# Altium project FPGA_Core_FX3.PrjPcb
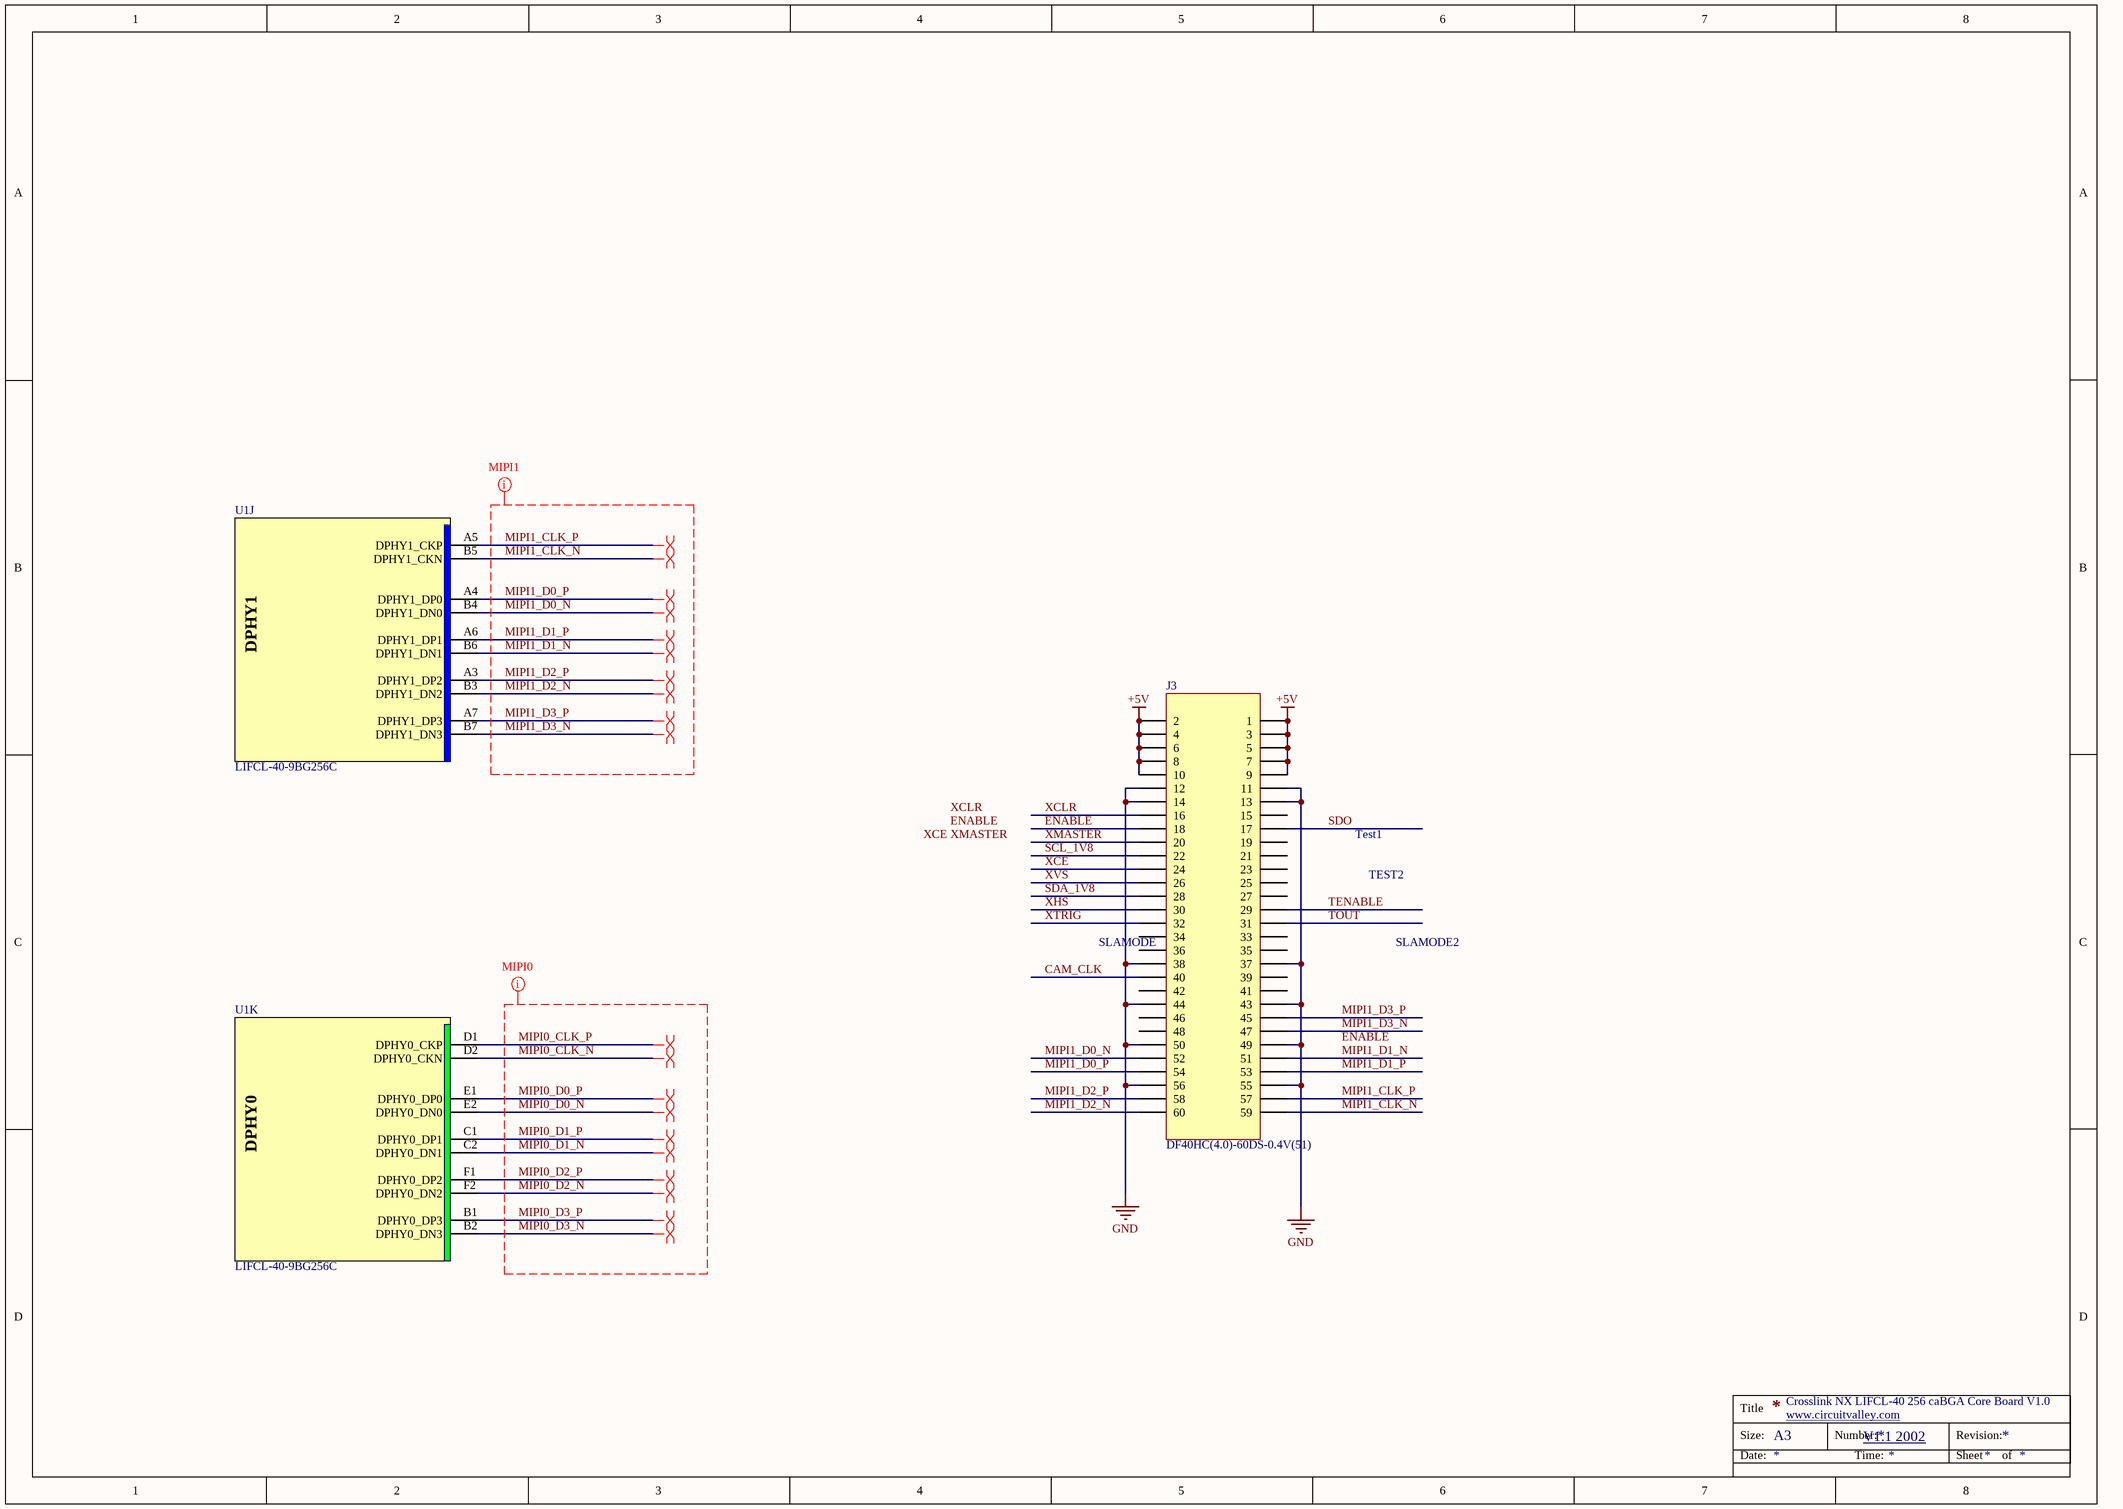
[diagram p0: camera.SchDoc]
6 sheets, 81 parts. Net scope: global (net labels, ports and power ports of the same name join across sheets).
Board file: FPGA_Core_FX3.PcbDoc
Sheets:
  camera.SchDoc
  power.SchDoc
  fpga_gpif.SchDoc
  fpga_power.SchDoc
  psram.SchDoc
  fpga_flash.SchDoc

## Sheet camera.SchDoc
size A3

### Parts
J3  DF40HC(4.0)-60DS-0.4V(51)  [DF40HC(4.0)-60DS-0.4V(51)]
U1  LIFCL-40-9BG256C  [Lattice_256_CABGA]  (parts J,K of 14)

### Nets
+5V: J3.1 J3.2 J3.3 J3.4 J3.5 J3.6 J3.7 J3.8 J3.9 J3.10
GND: J3.11 J3.12 J3.13 J3.14 J3.37 J3.38 J3.43 J3.44 J3.49 J3.50 J3.55 J3.56
CAM_CLK: J3.40
ENABLE: J3.18
MIPI0_CLK_N: U1.D2(DPHY0_CKN)
MIPI0_CLK_P: U1.D1(DPHY0_CKP)
MIPI0_D0_N: U1.E2(DPHY0_DN0)
MIPI0_D0_P: U1.E1(DPHY0_DP0)
MIPI0_D1_N: U1.C2(DPHY0_DN1)
MIPI0_D1_P: U1.C1(DPHY0_DP1)
MIPI0_D2_N: U1.F2(DPHY0_DN2)
MIPI0_D2_P: U1.F1(DPHY0_DP2)
MIPI0_D3_N: U1.B2(DPHY0_DN3)
MIPI0_D3_P: U1.B1(DPHY0_DP3)
MIPI1_CLK_N: J3.59 U1.B5(DPHY1_CKN)
MIPI1_CLK_P: J3.57 U1.A5(DPHY1_CKP)
MIPI1_D0_N: J3.52 U1.B4(DPHY1_DN0)
MIPI1_D0_P: J3.54 U1.A4(DPHY1_DP0)
MIPI1_D1_N: J3.51 U1.B6(DPHY1_DN1)
MIPI1_D1_P: J3.53 U1.A6(DPHY1_DP1)
MIPI1_D2_N: J3.60 U1.B3(DPHY1_DN2)
MIPI1_D2_P: J3.58 U1.A3(DPHY1_DP2)
MIPI1_D3_N: J3.47 U1.B7(DPHY1_DN3)
MIPI1_D3_P: J3.45 U1.A7(DPHY1_DP3)
SCL_1V8: J3.22
SDA_1V8: J3.28
SDO: J3.17
TENABLE: J3.29
TOUT: J3.31
XCE: J3.24
XCLR: J3.16
XHS: J3.30
XMASTER: J3.20
XTRIG: J3.32
XVS: J3.26

Not connected (* = marked no-connect by the designer): J3 15 19 21 23 25 27 33 34 35 36 39 41 42 46 48

### Layout directives
differential pair: MIPI0_CLK_N, MIPI0_CLK_P, MIPI0_D0_N, MIPI0_D0_P, MIPI0_D1_N, MIPI0_D1_P, MIPI0_D2_N, MIPI0_D2_P, MIPI0_D3_N, MIPI0_D3_P, MIPI1_CLK_N, MIPI1_CLK_P, MIPI1_D0_N, MIPI1_D0_P, MIPI1_D1_N, MIPI1_D1_P, MIPI1_D2_N, MIPI1_D2_P, MIPI1_D3_N, MIPI1_D3_P
net class MIPI0: MIPI0_CLK_N, MIPI0_CLK_P, MIPI0_D0_N, MIPI0_D0_P, MIPI0_D1_N, MIPI0_D1_P, MIPI0_D2_N, MIPI0_D2_P, MIPI0_D3_N, MIPI0_D3_P
net class MIPI1: MIPI1_CLK_N, MIPI1_CLK_P, MIPI1_D0_N, MIPI1_D0_P, MIPI1_D1_N, MIPI1_D1_P, MIPI1_D2_N, MIPI1_D2_P, MIPI1_D3_N, MIPI1_D3_P

### Notes on the sheet
- Test1
- TEST2
- SLAMODE
- SLAMODE2
- Crosslink NX LIFCL-40 256 caBGA Core Board V1.0
- www.circuitvalley.com <http://www.circuitvalley.com>
- V1.1 2002
- Labels drawn without touching a wire or pin: ENABLE, XCE, XCLR, XMASTER
- Title
- Size:
- Date:
- A3
- Number:
- Time:
- Revision:
- Sheet
- of
- (in symbol LIFCL-40-9BG256C, part J) DPHY1
- (in symbol LIFCL-40-9BG256C, part K) DPHY0

### Library data of the parts
J3 = DF40HC(4.0)-60DS-0.4V(51): Hiros 60 pin Connector
U1 = LIFCL-40-9BG256C: FPGA CorsslinkNX  LIFCL-40-9BG256C

## Sheet power.SchDoc
size A3
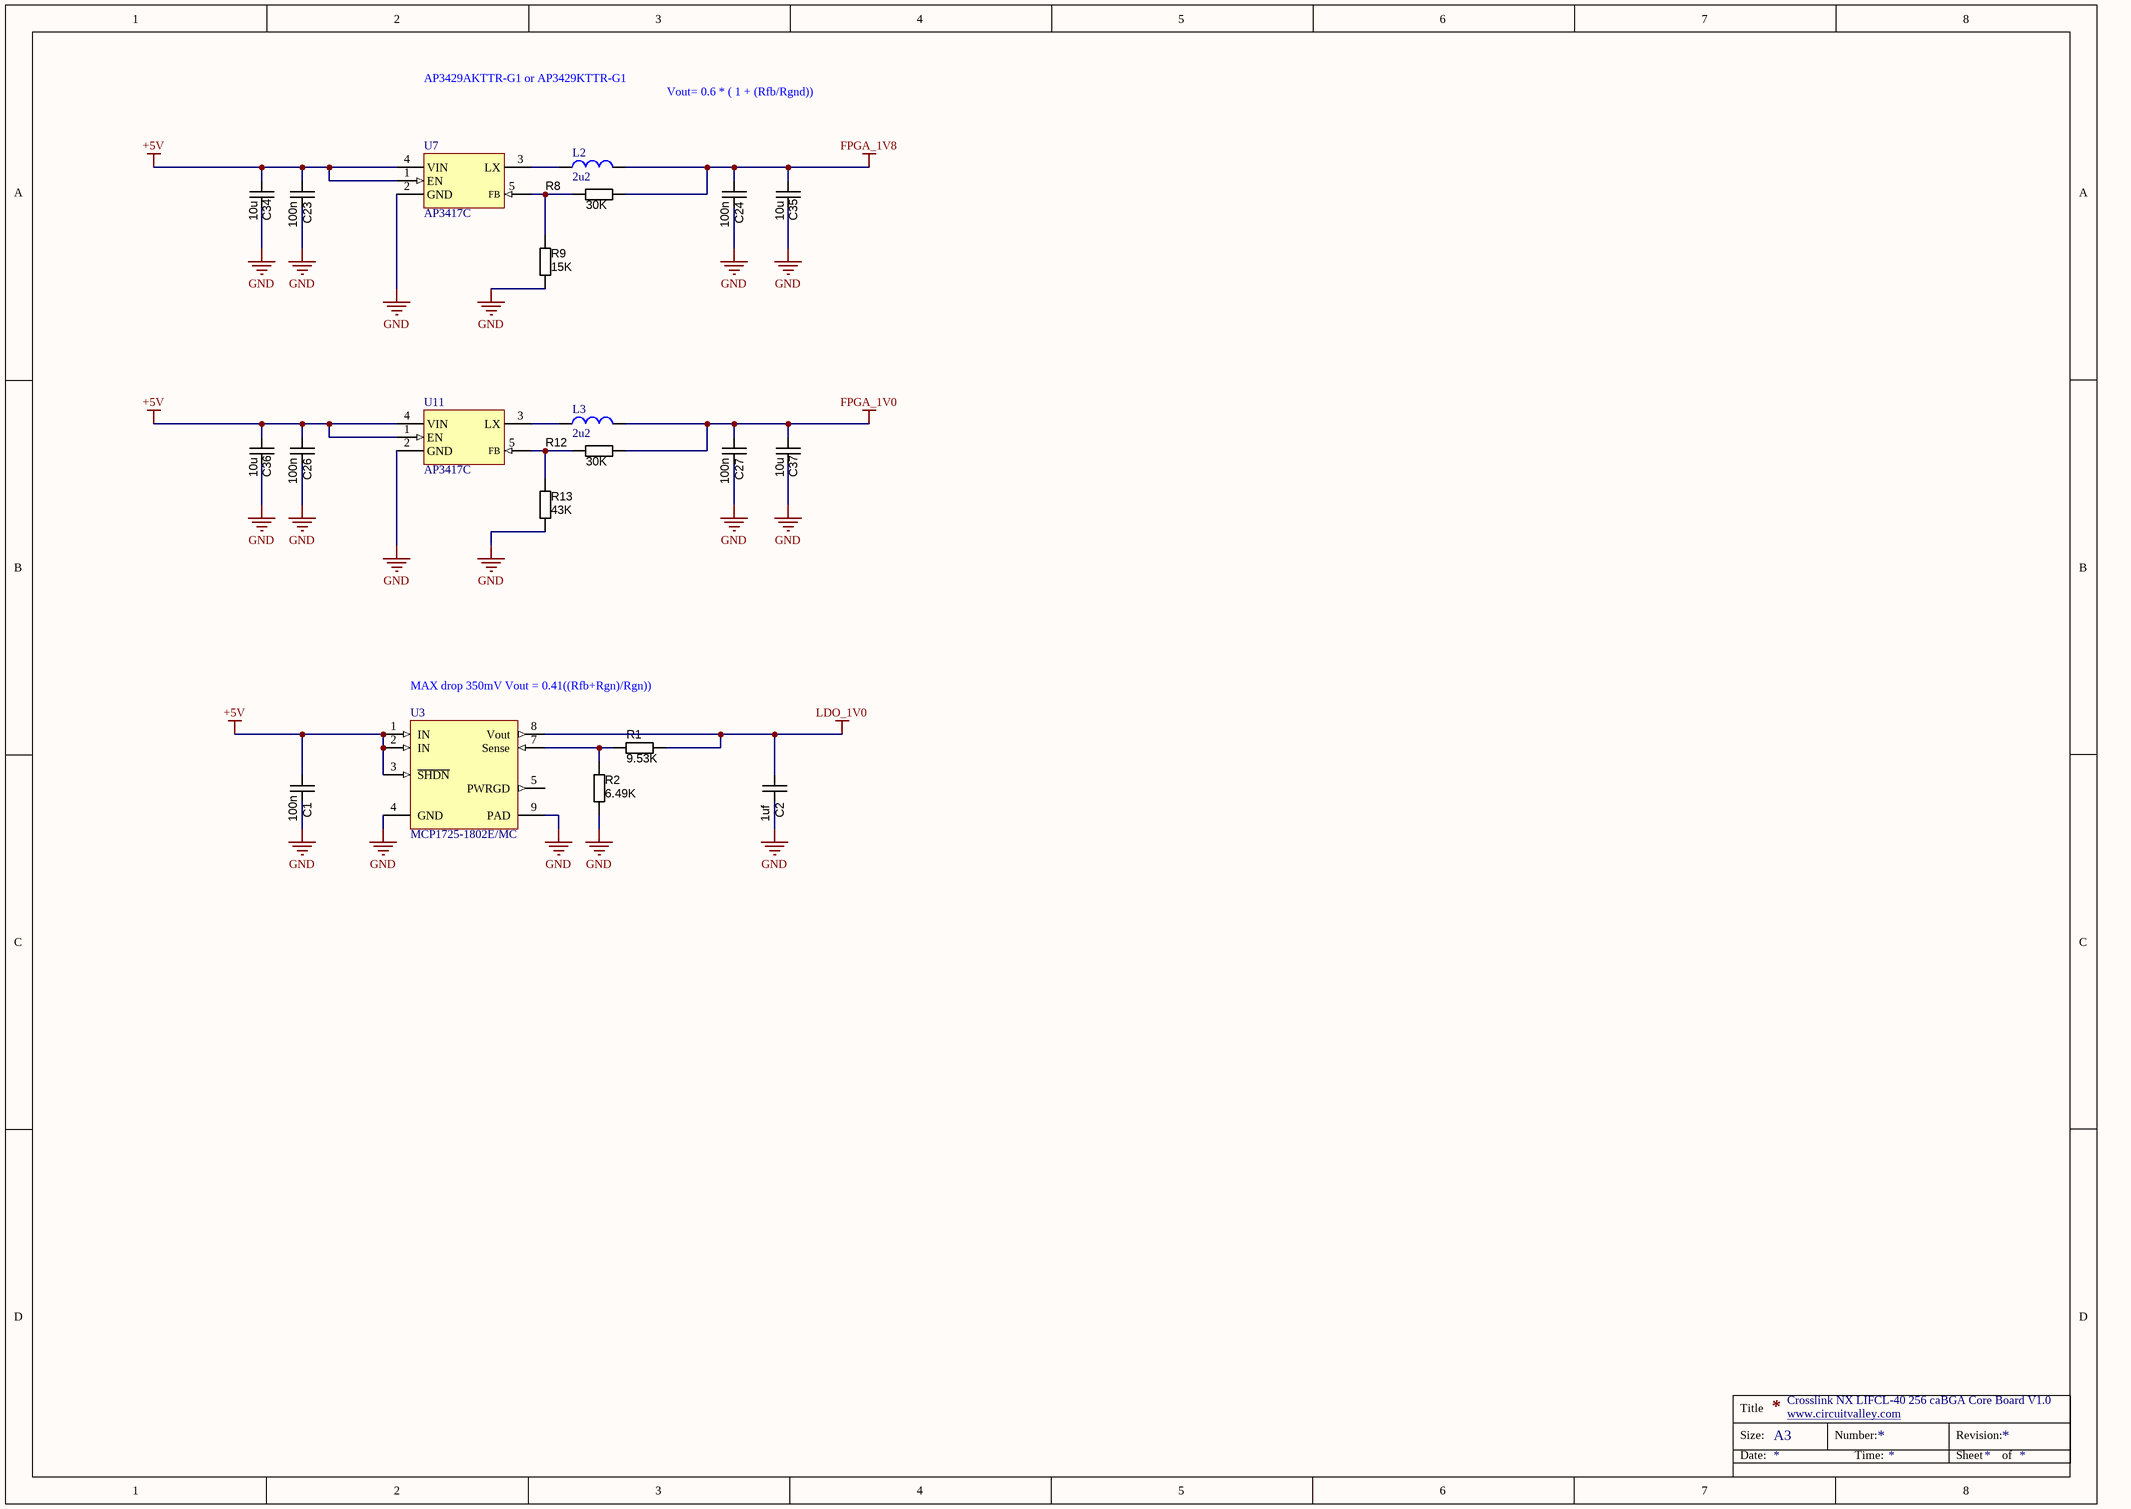
[diagram p1: power.SchDoc]

### Parts
C1  100n  [CAPC1005N]
C2  1uf  [CAPC1005N]
C23  100n  [CAPC1005N]
C24  100n  [CAPC1005N]
C26  100n  [CAPC1005N]
C27  100n  [CAPC1005N]
C34  value 10u  [CAPC1608N]  (hidden comment: approved sub OK)
C35  value 10u  [CAPC1608N]  (hidden comment: approved sub OK)
C36  value 10u  [CAPC1608N]  (hidden comment: approved sub OK)
C37  value 10u  [CAPC1608N]  (hidden comment: approved sub OK)
L2  2u2  [FDSD0420-H-2R2M]
L3  2u2  [FDSD0420-H-2R2M]
R1  value 9.53K  [RESC1005N]  (hidden comment: Thick Film)
R2  value 6.49K  [RESC1005N]  (hidden comment: Thick Film)
R8  value 30K  [RESC1005N]  (hidden comment: Thick Film)
R9  value 15K  [RESC1005N]  (hidden comment: Thick Film)
R12  value 30K  [RESC1005N]  (hidden comment: Thick Film)
R13  value 43K  [RESC1005N]  (hidden comment: Thick Film)
U3  MCP1725-1802E/MC  [DFN8_3x2]
U7  AP3417C  [SOT23-5]
U11  AP3417C  [SOT23-5]

### Nets
+5V: C1.2 C23.2 C26.2 C34.1 C36.1 U3.1(IN) U3.2(IN) U3.3(~{SHDN}) U7.1(EN) U7.4(VIN) U11.1(EN) U11.4(VIN)
FPGA_1V0: C27.2 C37.1 L3.2 R12.2
FPGA_1V8: C24.2 C35.1 L2.2 R8.2
GND: C1.1 C2.1 C23.1 C24.1 C26.1 C27.1 C34.2 C35.2 C36.2 C37.2 R2.1 R9.2 R13.1 U3.4(GND) U3.9(PAD) U7.2(GND) U11.2(GND)
LDO_1V0: C2.2 R1.2 U3.8(Vout)
NetL2_1: L2.1 U7.3(LX)
NetL3_1: L3.1 U11.3(LX)
NetR1_1: R1.1 R2.2 U3.7(Sense)
NetR8_1: R8.1 R9.1 U7.5(FB)
NetR12_1: R12.1 R13.2 U11.5(FB)

Not connected (* = marked no-connect by the designer): U3 5(PWRGD)

### Notes on the sheet
- AP3429AKTTR-G1 or AP3429KTTR-G1
- Vout= 0.6 * ( 1 + (Rfb/Rgnd))
- MAX drop 350mV Vout = 0.41((Rfb+Rgn)/Rgn))
- Crosslink NX LIFCL-40 256 caBGA Core Board V1.0
- www.circuitvalley.com <http://www.circuitvalley.com>
- Title
- Size:
- Date:
- A3
- Number:
- Time:
- Revision:
- Sheet
- of

### Library data of the parts
C1 C2 C23 C24 C26 C27 = CAPC_10n_0402_16V_10%: Capacitor SMD Cer 10nF 10% 16V X7R 0402; Manufacturer 1: AVX Corporation; Manufacturer Part Number 1: 0402YC103KAT2A; Ratings: 16V; X7R; Tolerance: ±10%; Operating Temperature: -55°C ~ 125°C; Package / Case: 0402 (1005 Metric); Size / Dimension: 0.039" L x 0.020" W (1.00mm x 0.50mm); Manufacturer 2: Yageo; Manufacturer Part Number 2: CC0402KRX7R7BB103; Supplier 1: Digi-Key; Supplier Part Number 1: 478-1114-1-ND; ComponentLink1URL: http://www.avx.com/docs/Catalogs/cx7r.pdf; ComponentLink1Description: http://www.avx.com/docs/Catalogs/cx7r.pdf; Supplier 2: Digi-Key; Supplier Part Number 2: 311-1042-1-ND; ComponentLink2URL: http://www.yageo.com/documents/recent/UPY-GPHC_X7R_6.3V-to-50V_8.pdf; ComponentLink2Description: http://www.yageo.com/documents/recent/UPY-GPHC_X7R_6.3V-to-50V_8.pdf
  C1 C23 C24 C26 C27: Value: 100n
  C2: Value: 1uf
C34-C37 = CAPC_560p_0603_5%: Capacitor SMD Cer 560pF 5% 50V NP0 0603; Manufacturer 1: AVX Corporation; Manufacturer Part Number 1: 06035A561JAT2A; Ratings: 50V; NP0; Material: ceramic; Capacitance: 470pF; Package / Case: 0603 (1608 metric); Voltage - Rated: 50V; Mounting Type: Surface Mount, MLCC; Operating Temperature: -55°C ~ 125°C; Applications: General Purpose; Size / Dimension: 0.063" L x 0.032" W (1.60mm x 0.81mm); Height - Seated (Max): -; Thickness (Max): 0.035" (0.90mm); Lead Spacing: -; Lead Style: -; ComponentLink1URL: http://www.avx.com/docs/Catalogs/ccog.pdf; ComponentLink1Description: http://www.avx.com/docs/Catalogs/ccog.pdf; Supplier 1: Digi-Key; Supplier Part Number 1: 478-1184-1-ND
L2 L3 = inductor_smd
R1 R2 R8 R9 R12 R13 = RES_3K3_0402_5%: Resistor SMD chip 3.3k Ohm 0.063W 5% 0402; Manufacturer 1: Yageo; Manufacturer Part Number 1: RC0402JR-073K3L; Ratings: 1/16 W; Package / Case: 0402 (1005 metric); Tolerance: ±5%; Material: Thick Film; Supplier 1: Digi-Key; Supplier Part Number 1: 311-3.3KJRCT-ND; ComponentLink1URL: http://www.yageo.com/documents/recent/PYu-RC0402_51_RoHS_L_6.pdf; ComponentLink1Description: http://www.yageo.com/documents/recent/PYu-RC0402_51_RoHS_L_6.pdf
U3 = MCP1725: LDO

## Sheet fpga_gpif.SchDoc
size A3
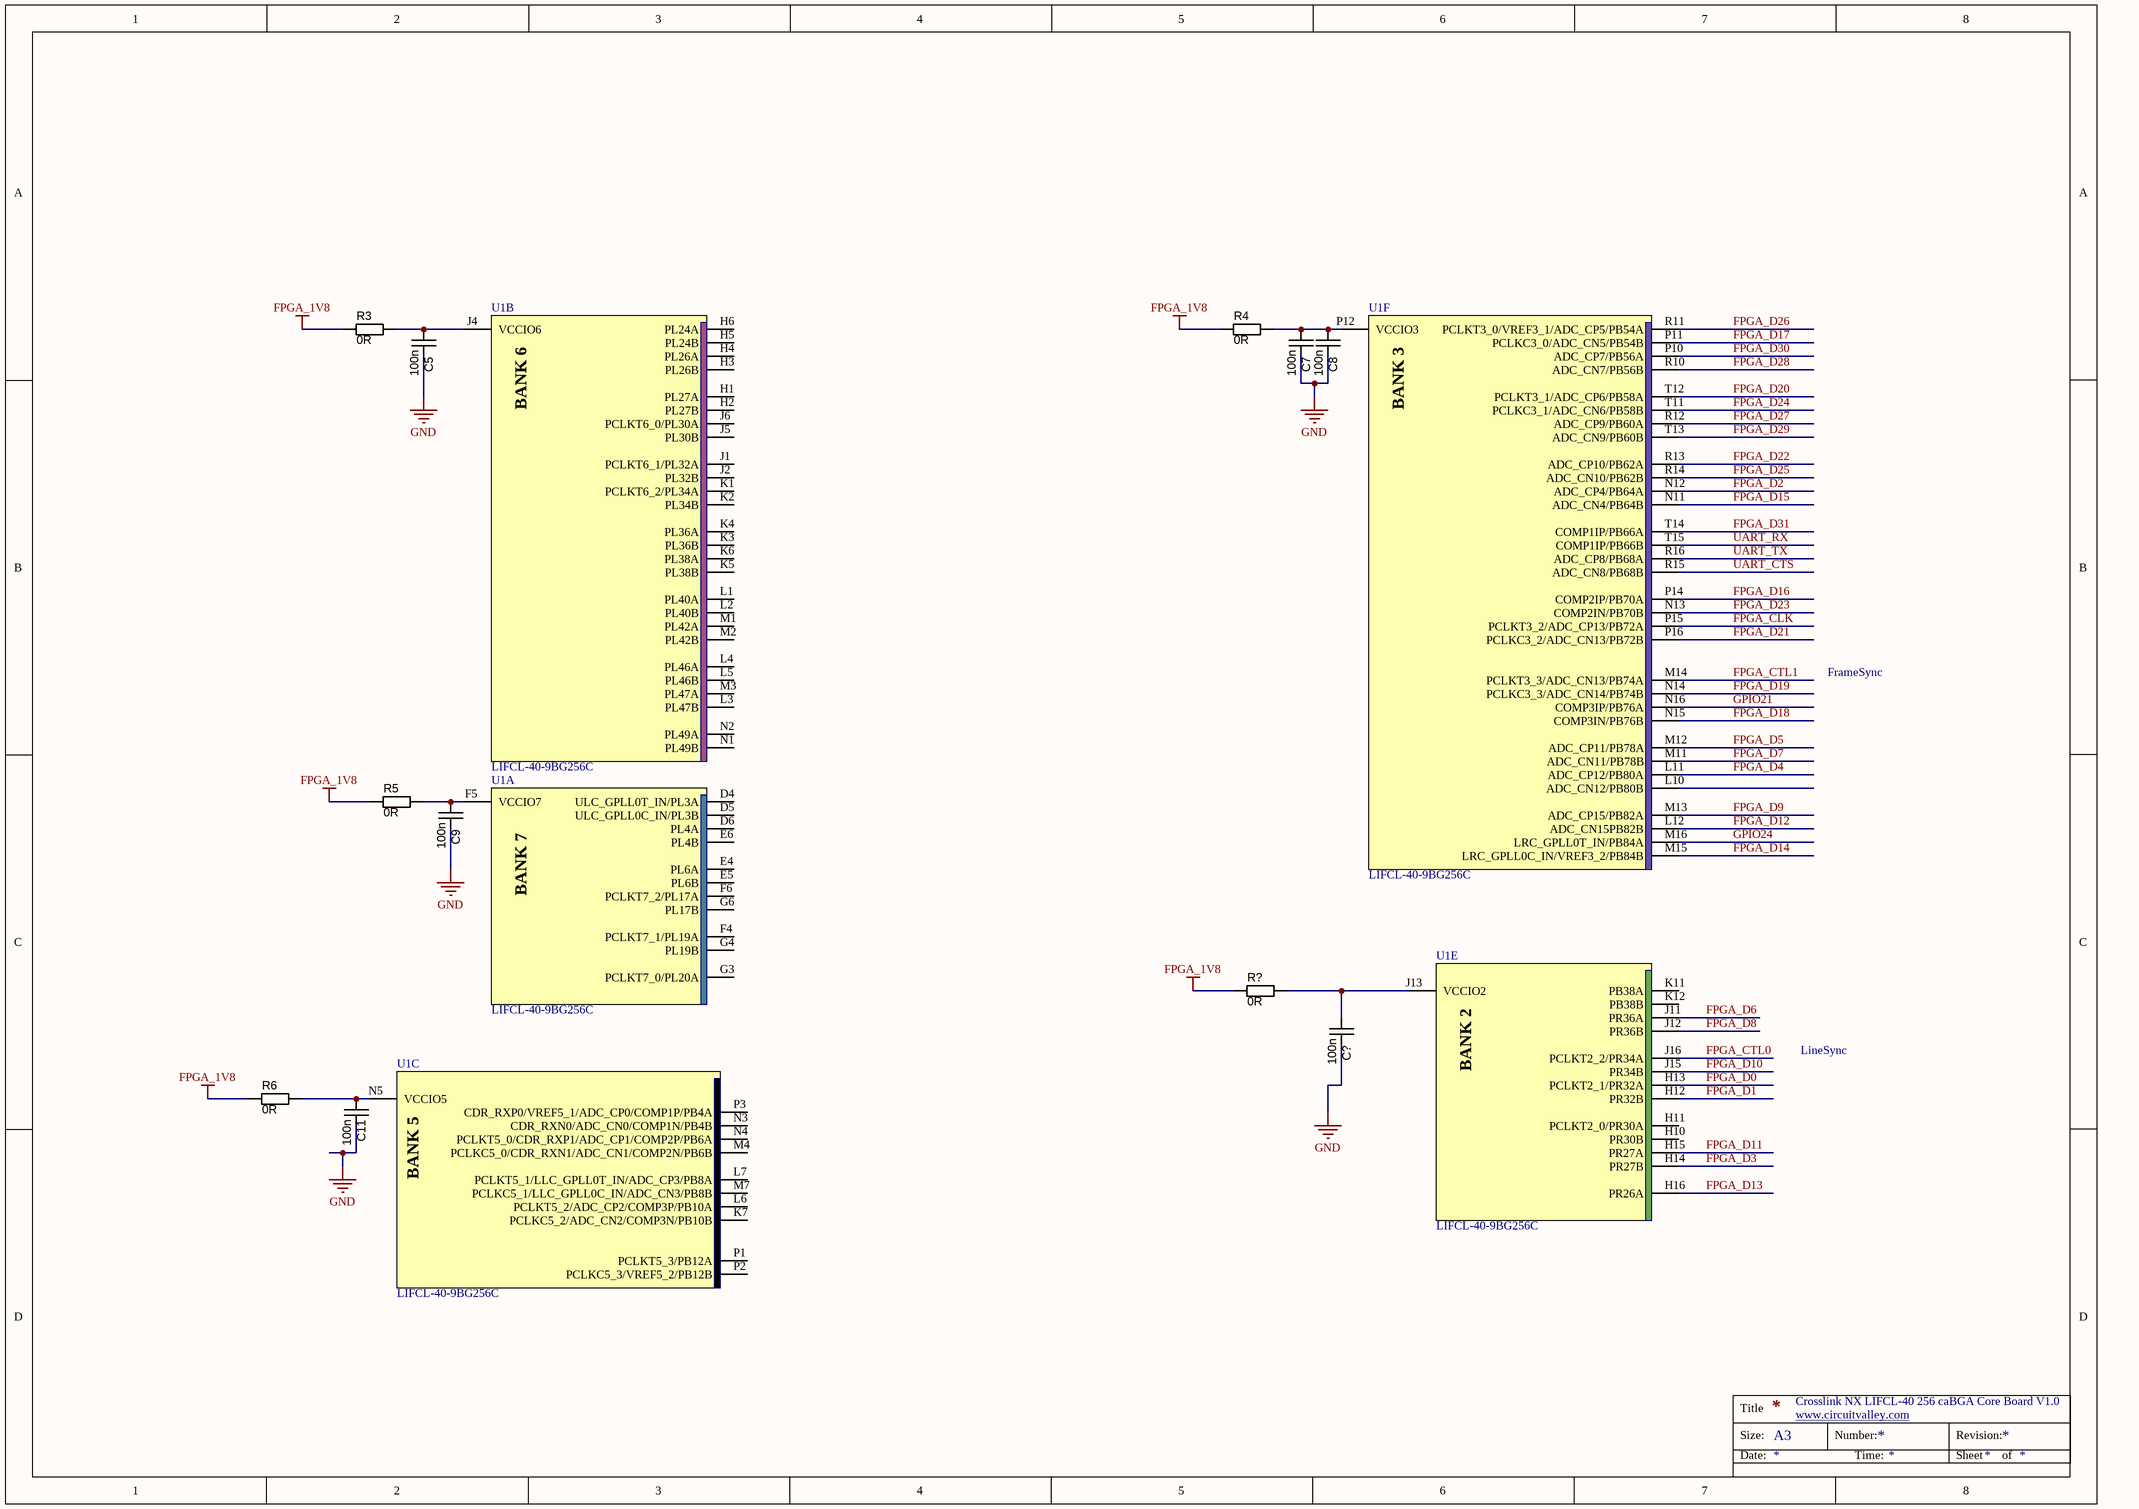
[diagram p2: fpga_gpif.SchDoc]

### Parts
C5  100n  [CAPC1005N]
C7  100n  [CAPC1005N]
C8  100n  [CAPC1005N]
C9  100n  [CAPC1005N]
C11  100n  [CAPC1005N]
C?  100n  [CAPC1005N]
R3  value 0R  [RESC1005N]  (hidden comment: Thick Film)
R4  value 0R  [RESC1005N]  (hidden comment: Thick Film)
R5  value 0R  [RESC1005N]  (hidden comment: Thick Film)
R6  value 0R  [RESC1005N]  (hidden comment: Thick Film)
R?  value 0R  [RESC1005N]  (hidden comment: Thick Film)
U1  LIFCL-40-9BG256C  [Lattice_256_CABGA]  (parts A,B,C,E,F of 14)

### Nets
FPGA_1V8: R3.1 R4.1 R5.1 R6.1 R?.1
GND: C5.1 C7.1 C8.1 C9.1 C11.1 C?.1
FPGA_CLK: U1.P15(PCLKT3_2/ADC_CP13/PB72A)
FPGA_CTL0: U1.J16(PCLKT2_2/PR34A)
FPGA_CTL1: U1.M14(PCLKT3_3/ADC_CN13/PB74A)
FPGA_D0: U1.H13(PCLKT2_1/PR32A)
FPGA_D1: U1.H12(PR32B)
FPGA_D2: U1.N12(ADC_CP4/PB64A)
FPGA_D3: U1.H14(PR27B)
FPGA_D4: U1.L11(ADC_CP12/PB80A)
FPGA_D5: U1.M12(ADC_CP11/PB78A)
FPGA_D6: U1.J11(PR36A)
FPGA_D7: U1.M11(ADC_CN11/PB78B)
FPGA_D8: U1.J12(PR36B)
FPGA_D9: U1.M13(ADC_CP15/PB82A)
FPGA_D10: U1.J15(PR34B)
FPGA_D11: U1.H15(PR27A)
FPGA_D12: U1.L12(ADC_CN15PB82B)
FPGA_D13: U1.H16(PR26A)
FPGA_D14: U1.M15(LRC_GPLL0C_IN/VREF3_2/PB84B)
FPGA_D15: U1.N11(ADC_CN4/PB64B)
FPGA_D16: U1.P14(COMP2IP/PB70A)
FPGA_D17: U1.P11(PCLKC3_0/ADC_CN5/PB54B)
FPGA_D18: U1.N15(COMP3IN/PB76B)
FPGA_D19: U1.N14(PCLKC3_3/ADC_CN14/PB74B)
FPGA_D20: U1.T12(PCLKT3_1/ADC_CP6/PB58A)
FPGA_D21: U1.P16(PCLKC3_2/ADC_CN13/PB72B)
FPGA_D22: U1.R13(ADC_CP10/PB62A)
FPGA_D23: U1.N13(COMP2IN/PB70B)
FPGA_D24: U1.T11(PCLKC3_1/ADC_CN6/PB58B)
FPGA_D25: U1.R14(ADC_CN10/PB62B)
FPGA_D26: U1.R11(PCLKT3_0/VREF3_1/ADC_CP5/PB54A)
FPGA_D27: U1.R12(ADC_CP9/PB60A)
FPGA_D28: U1.R10(ADC_CN7/PB56B)
FPGA_D29: U1.T13(ADC_CN9/PB60B)
FPGA_D30: U1.P10(ADC_CP7/PB56A)
FPGA_D31: U1.T14(COMP1IP/PB66A)
GPIO21: U1.N16(COMP3IP/PB76A)
GPIO24: U1.M16(LRC_GPLL0T_IN/PB84A)
UART_CTS: U1.R15(ADC_CN8/PB68B)
UART_RX: U1.T15(COMP1IP/PB66B)
UART_TX: U1.R16(ADC_CP8/PB68A)
NetC5_2: C5.2 R3.2 U1.J4(VCCIO6)
NetC7_2: C7.2 C8.2 R4.2 U1.P12(VCCIO3)
NetC9_2: C9.2 R5.2 U1.F5(VCCIO7)
NetC11_2: C11.2 R6.2 U1.N5(VCCIO5)
NetC?_2: C?.2 R?.2 U1.J13(VCCIO2)

Not connected (* = marked no-connect by the designer): U1 D4(ULC_GPLL0T_IN/PL3A) D5(ULC_GPLL0C_IN/PL3B) D6(PL4A) E4(PL6A) E5(PL6B) E6(PL4B) F4(PCLKT7_1/PL19A) F6(PCLKT7_2/PL17A) G3(PCLKT7_0/PL20A) G4(PL19B) G6(PL17B) H1(PL27A) H2(PL27B) H3(PL26B) H4(PL26A) H5(PL24B) H6(PL24A) H10(PR30B) H11(PCLKT2_0/PR30A) J1(PCLKT6_1/PL32A) J2(PL32B) J5(PL30B) J6(PCLKT6_0/PL30A) K1(PCLKT6_2/PL34A) K2(PL34B) K3(PL36B) K4(PL36A) K5(PL38B) K6(PL38A) K7(PCLKC5_2/ADC_CN2/COMP3N/PB10B) K11(PB38A) K12(PB38B) L1(PL40A) L2(PL40B) L3(PL47B) L4(PL46A) L5(PL46B) L6(PCLKT5_2/ADC_CP2/COMP3P/PB10A) L7(PCLKT5_1/LLC_GPLL0T_IN/ADC_CP3/PB8A) L10(ADC_CN12/PB80B) M1(PL42A) M2(PL42B) M3(PL47A) M4(PCLKC5_0/CDR_RXN1/ADC_CN1/COMP2N/PB6B) M7(PCLKC5_1/LLC_GPLL0C_IN/ADC_CN3/PB8B) N1(PL49B) N2(PL49A) N3(CDR_RXN0/ADC_CN0/COMP1N/PB4B) N4(PCLKT5_0/CDR_RXP1/ADC_CP1/COMP2P/PB6A) P1(PCLKT5_3/PB12A) P2(PCLKC5_3/VREF5_2/PB12B) P3(CDR_RXP0/VREF5_1/ADC_CP0/COMP1P/PB4A)

### Notes on the sheet
- FrameSync
- LineSync
- Crosslink NX LIFCL-40 256 caBGA Core Board V1.0
- www.circuitvalley.com <http://www.circuitvalley.com>
- Title
- Size:
- Date:
- A3
- Number:
- Time:
- Revision:
- Sheet
- of
- (in symbol LIFCL-40-9BG256C, part A) BANK 7
- (in symbol LIFCL-40-9BG256C, part B) BANK 6
- (in symbol LIFCL-40-9BG256C, part C) BANK 5
- (in symbol LIFCL-40-9BG256C, part E) BANK 2
- (in symbol LIFCL-40-9BG256C, part F) BANK 3

### Library data of the parts
C5 C7-C9 C11 C? = CAPC_10n_0402_16V_10%: as C1 on sheet power; Tolerance: ±10%; Operating Temperature: -55°C ~ 125°C; Package / Case: 0402 (1005 Metric); Size / Dimension: 0.039" L x 0.020" W (1.00mm x 0.50mm); Manufacturer 2: Yageo; Manufacturer Part Number 2: CC0402KRX7R7BB103; Supplier 1: Digi-Key; Supplier Part Number 1: 478-1114-1-ND; ComponentLink1URL: http://www.avx.com/docs/Catalogs/cx7r.pdf; ComponentLink1Description: http://www.avx.com/docs/Catalogs/cx7r.pdf; Supplier 2: Digi-Key; Supplier Part Number 2: 311-1042-1-ND; ComponentLink2URL: http://www.yageo.com/documents/recent/UPY-GPHC_X7R_6.3V-to-50V_8.pdf; ComponentLink2Description: http://www.yageo.com/documents/recent/UPY-GPHC_X7R_6.3V-to-50V_8.pdf; Value: 100n
R3-R6 R? = RES_3K3_0402_5%: as R1 on sheet power; Package / Case: 0402 (1005 metric); Tolerance: ±5%; Material: Thick Film; Supplier 1: Digi-Key; Supplier Part Number 1: 311-3.3KJRCT-ND; ComponentLink1URL: http://www.yageo.com/documents/recent/PYu-RC0402_51_RoHS_L_6.pdf; ComponentLink1Description: http://www.yageo.com/documents/recent/PYu-RC0402_51_RoHS_L_6.pdf
U1 = LIFCL-40-9BG256C: FPGA CorsslinkNX  LIFCL-40-9BG256C

## Sheet fpga_power.SchDoc
size A3
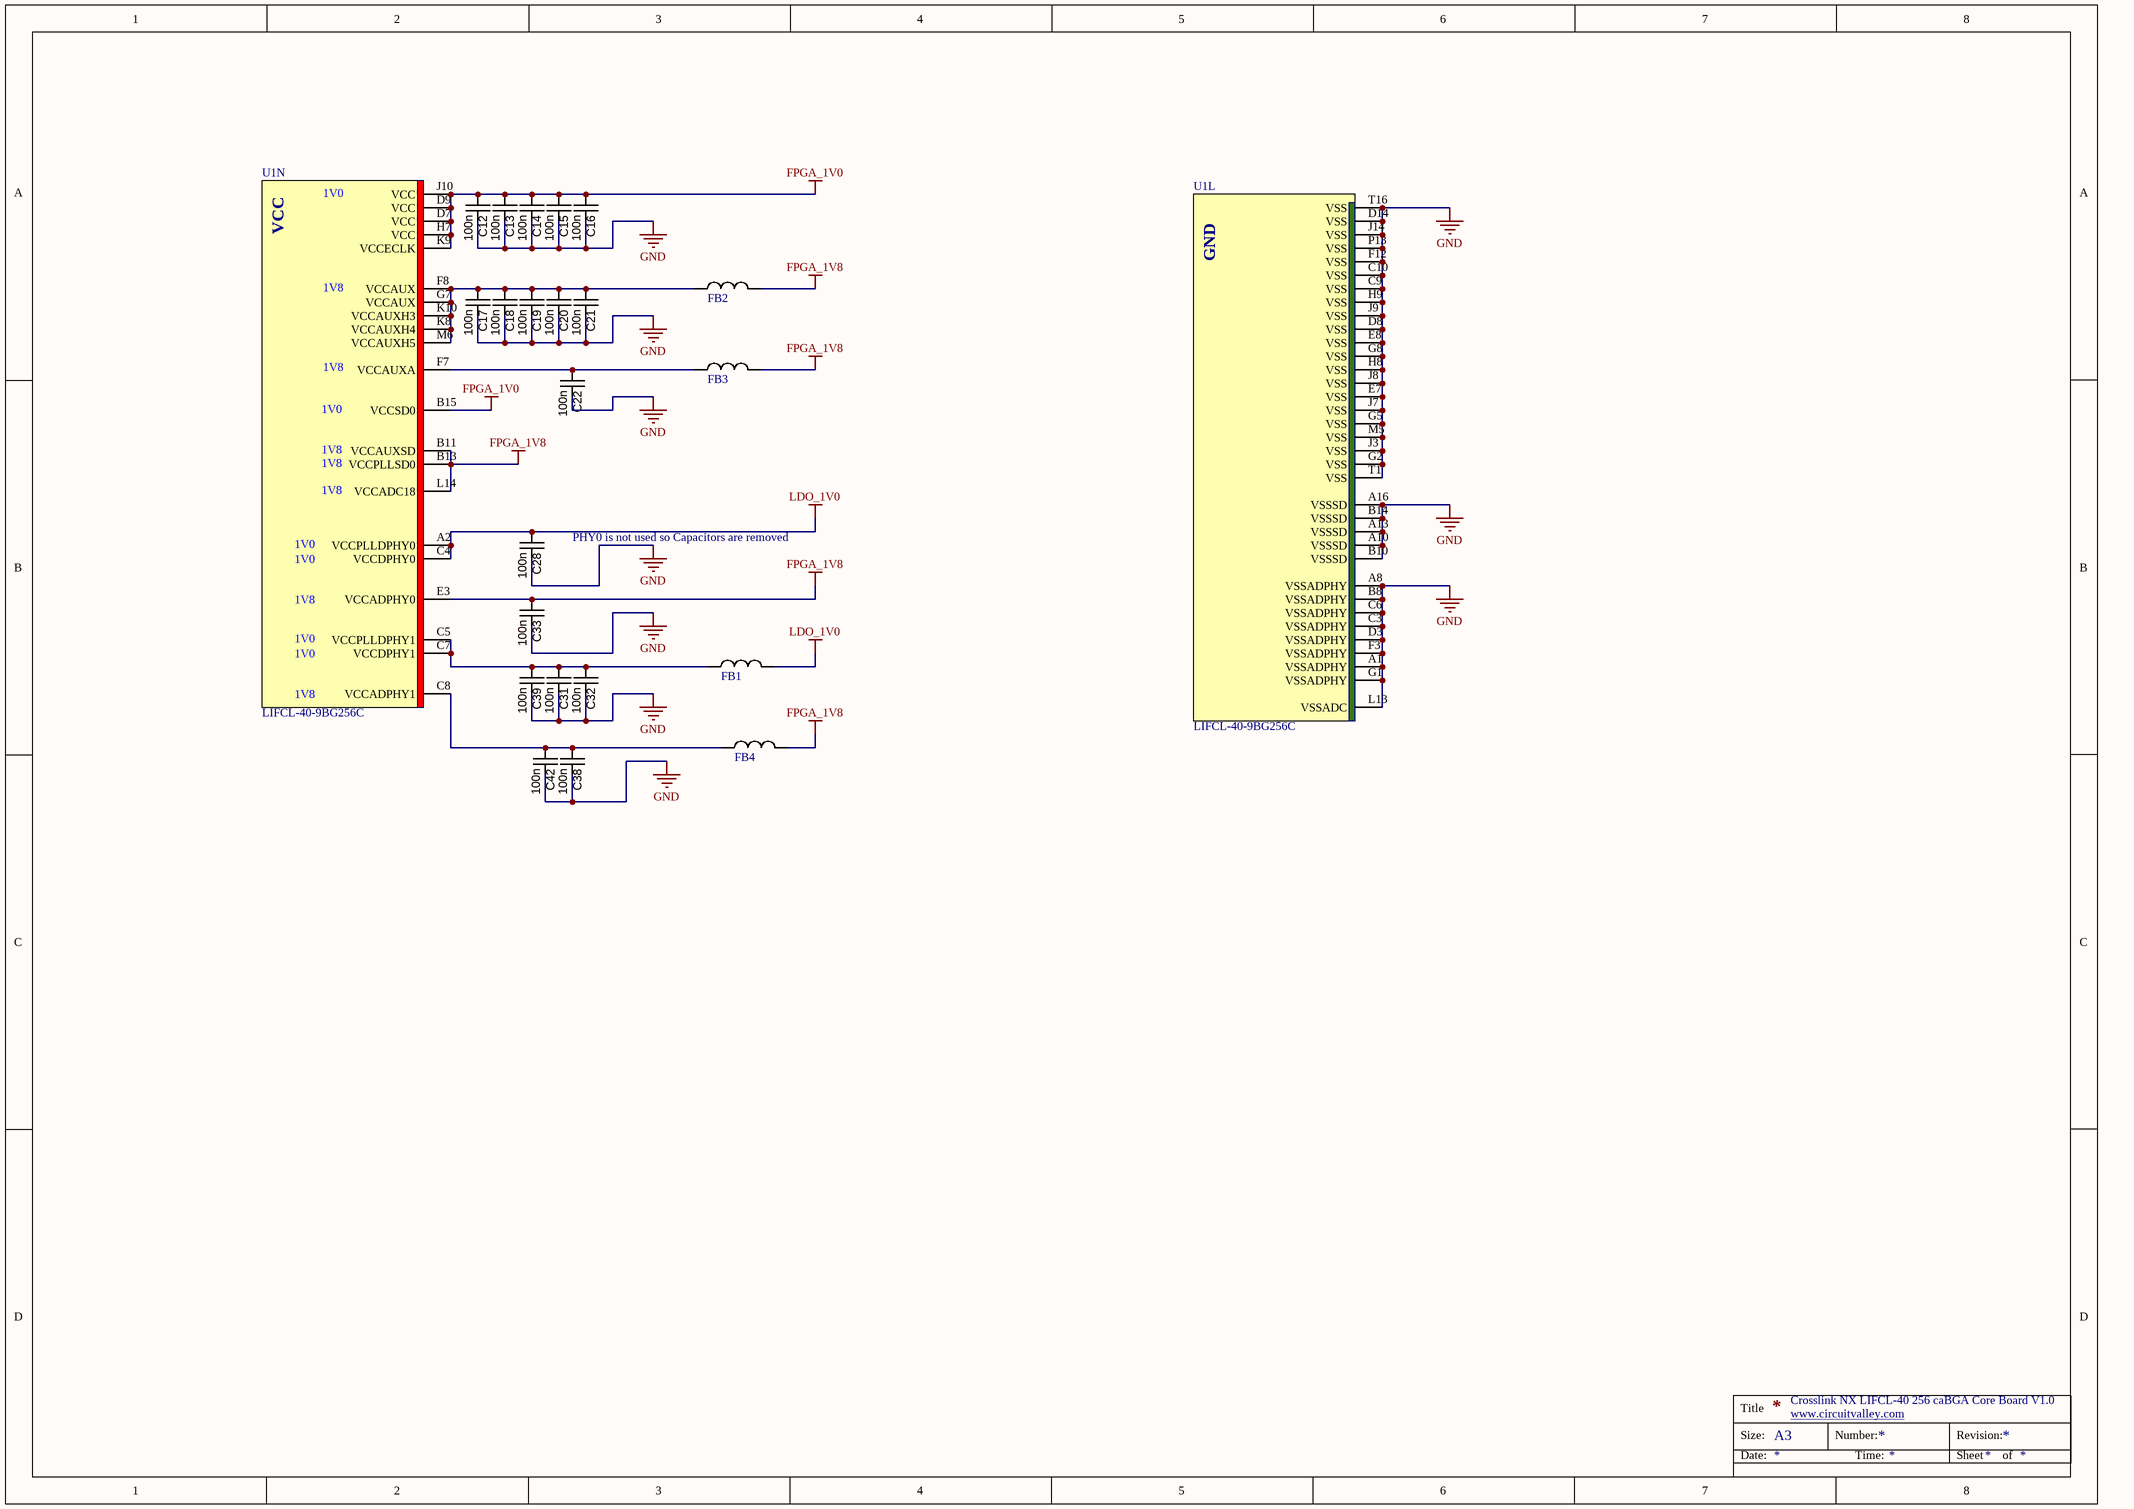
[diagram p3: fpga_power.SchDoc]

### Parts
C12  100n  [CAPC1005N]
C13  100n  [CAPC1005N]
C14  100n  [CAPC1005N]
C15  100n  [CAPC1005N]
C16  100n  [CAPC1005N]
C17  100n  [CAPC1005N]
C18  100n  [CAPC1005N]
C19  100n  [CAPC1005N]
C20  100n  [CAPC1005N]
C21  100n  [CAPC1005N]
C22  100n  [CAPC1005N]
C28  100n  [CAPC1005N]
C31  100n  [CAPC1005N]
C32  100n  [CAPC1005N]
C33  100n  [CAPC1005N]
C38  100n  [CAPC1005N]
C39  100n  [CAPC1005N]
C42  100n  [CAPC1005N]
FB1  Ferrite  [INDC1608N]  (value not drawn)
FB2  Ferrite  [INDC1608N]  (value not drawn)
FB3  Ferrite  [INDC1608N]  (value not drawn)
FB4  Ferrite  [INDC1608N]  (value not drawn)
U1  LIFCL-40-9BG256C  [Lattice_256_CABGA]  (parts L,N of 14)

### Nets
FPGA_1V0: C12.2 C13.2 C14.2 C15.2 C16.2 U1.B15(VCCSD0) U1.D7(VCC) U1.D9(VCC) U1.H7(VCC) U1.J10(VCC) U1.K9(VCCECLK)
FPGA_1V8: C33.2 FB2.2 FB3.2 FB4.2 U1.B11(VCCAUXSD) U1.B13(VCCPLLSD0) U1.E3(VCCADPHY0) U1.L14(VCCADC18)
GND: C12.1 C13.1 C14.1 C15.1 C16.1 C17.1 C18.1 C19.1 C20.1 C21.1 C22.1 C28.1 C31.1 C32.1 C33.1 C38.1 C39.1 C42.1 U1.A1(VSSADPHY) U1.A8(VSSADPHY) U1.A10(VSSSD) U1.A13(VSSSD) U1.A16(VSSSD) U1.B8(VSSADPHY) U1.B10(VSSSD) U1.B14(VSSSD) U1.C3(VSSADPHY) U1.C6(VSSADPHY) U1.C9(VSS) U1.C10(VSS) U1.D3(VSSADPHY) U1.D8(VSS) U1.D14(VSS) U1.E7(VSS) U1.E8(VSS) U1.F3(VSSADPHY) U1.F12(VSS) U1.G1(VSSADPHY) U1.G2(VSS) U1.G5(VSS) U1.G8(VSS) U1.H8(VSS) U1.H9(VSS) U1.J3(VSS) U1.J7(VSS) U1.J8(VSS) U1.J9(VSS) U1.J14(VSS) U1.L13(VSSADC) U1.M5(VSS) U1.P13(VSS) U1.T1(VSS) U1.T16(VSS)
LDO_1V0: C28.2 FB1.2 U1.A2(VCCPLLDPHY0) U1.C4(VCCDPHY0)
NetC17_2: C17.2 C18.2 C19.2 C20.2 C21.2 FB2.1 U1.F8(VCCAUX) U1.G7(VCCAUX) U1.K8(VCCAUXH4) U1.K10(VCCAUXH3) U1.M6(VCCAUXH5)
NetC22_2: C22.2 FB3.1 U1.F7(VCCAUXA)
NetC31_2: C31.2 C32.2 C39.2 FB1.1 U1.C5(VCCPLLDPHY1) U1.C7(VCCDPHY1)
NetC38_2: C38.2 C42.2 FB4.1 U1.C8(VCCADPHY1)

### Notes on the sheet
- (near C28) PHY0 is not used so Capacitors are removed
- Crosslink NX LIFCL-40 256 caBGA Core Board V1.0
- www.circuitvalley.com <http://www.circuitvalley.com>
- Title
- Size:
- Date:
- A3
- Number:
- Time:
- Revision:
- Sheet
- of
- (in symbol LIFCL-40-9BG256C, part L) GND
- (in symbol LIFCL-40-9BG256C, part N) 1V0; 1V8

### Library data of the parts
C12-C22 C28 C31-C33 C38 C39 C42 = CAPC_10n_0402_16V_10%: as C1 on sheet power; Tolerance: ±10%; Operating Temperature: -55°C ~ 125°C; Package / Case: 0402 (1005 Metric); Size / Dimension: 0.039" L x 0.020" W (1.00mm x 0.50mm); Manufacturer 2: Yageo; Manufacturer Part Number 2: CC0402KRX7R7BB103; Supplier 1: Digi-Key; Supplier Part Number 1: 478-1114-1-ND; ComponentLink1URL: http://www.avx.com/docs/Catalogs/cx7r.pdf; ComponentLink1Description: http://www.avx.com/docs/Catalogs/cx7r.pdf; Supplier 2: Digi-Key; Supplier Part Number 2: 311-1042-1-ND; ComponentLink2URL: http://www.yageo.com/documents/recent/UPY-GPHC_X7R_6.3V-to-50V_8.pdf; ComponentLink2Description: http://www.yageo.com/documents/recent/UPY-GPHC_X7R_6.3V-to-50V_8.pdf; Value: 100n
U1 = LIFCL-40-9BG256C: FPGA CorsslinkNX  LIFCL-40-9BG256C

## Sheet psram.SchDoc
size A3
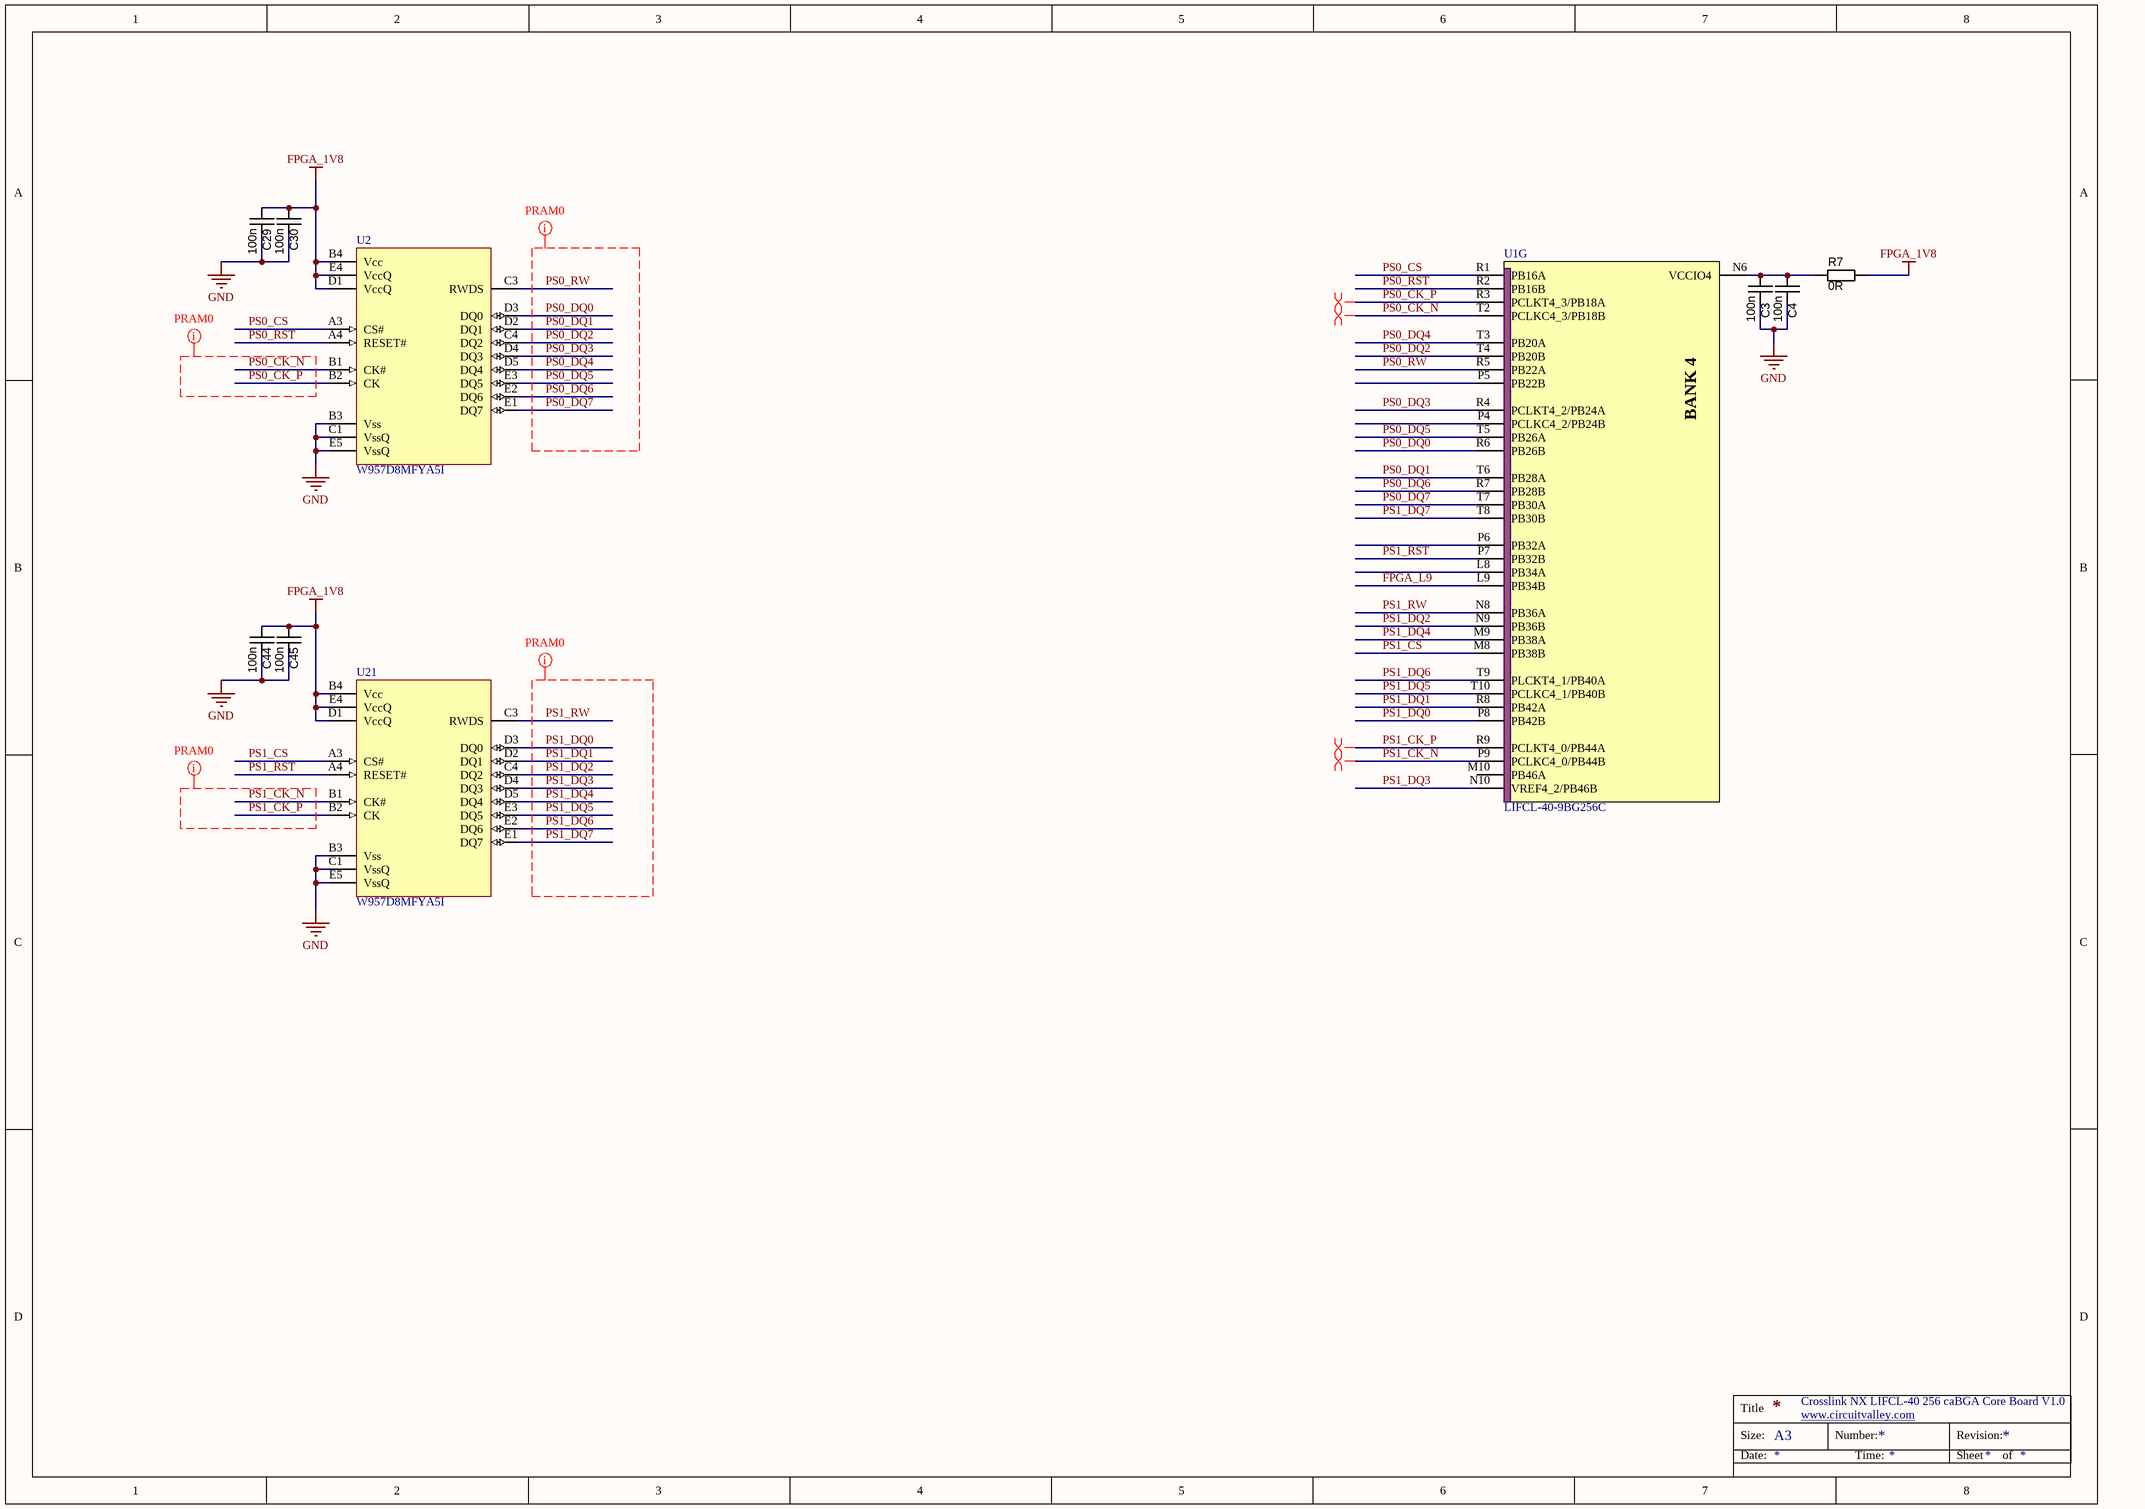
[diagram p4: psram.SchDoc]

### Parts
C3  100n  [CAPC1005N]
C4  100n  [CAPC1005N]
C29  100n  [CAPC1005N]
C30  100n  [CAPC1005N]
C44  100n  [CAPC1005N]
C45  100n  [CAPC1005N]
R7  value 0R  [RESC1005N]  (hidden comment: Thick Film)
U1  LIFCL-40-9BG256C  [Lattice_256_CABGA]  (part G of 14)
U2  W957D8MFYA5I  [TFBGA24]
U21  W957D8MFYA5I  [TFBGA24]

### Nets
FPGA_1V8: C29.2 C30.2 C44.2 C45.2 R7.2 U2.B4(Vcc) U2.D1(VccQ) U2.E4(VccQ) U21.B4(Vcc) U21.D1(VccQ) U21.E4(VccQ)
GND: C3.1 C4.1 C29.1 C30.1 C44.1 C45.1 U2.B3(Vss) U2.C1(VssQ) U2.E5(VssQ) U21.B3(Vss) U21.C1(VssQ) U21.E5(VssQ)
FPGA_L9: U1.L9(PB34B)
PS0_CK_N: U1.T2(PCLKC4_3/PB18B) U2.B1(CK#)
PS0_CK_P: U1.R3(PCLKT4_3/PB18A) U2.B2(CK)
PS0_CS: U1.R1(PB16A) U2.A3(CS#)
PS0_DQ0: U1.R6(PB26B) U2.D3(DQ0)
PS0_DQ1: U1.T6(PB28A) U2.D2(DQ1)
PS0_DQ2: U1.T4(PB20B) U2.C4(DQ2)
PS0_DQ3: U1.R4(PCLKT4_2/PB24A) U2.D4(DQ3)
PS0_DQ4: U1.T3(PB20A) U2.D5(DQ4)
PS0_DQ5: U1.T5(PB26A) U2.E3(DQ5)
PS0_DQ6: U1.R7(PB28B) U2.E2(DQ6)
PS0_DQ7: U1.T7(PB30A) U2.E1(DQ7)
PS0_RST: U1.R2(PB16B) U2.A4(RESET#)
PS0_RW: U1.R5(PB22A) U2.C3(RWDS)
PS1_CK_N: U1.P9(PCLKC4_0/PB44B) U21.B1(CK#)
PS1_CK_P: U1.R9(PCLKT4_0/PB44A) U21.B2(CK)
PS1_CS: U1.M8(PB38B) U21.A3(CS#)
PS1_DQ0: U1.P8(PB42B) U21.D3(DQ0)
PS1_DQ1: U1.R8(PB42A) U21.D2(DQ1)
PS1_DQ2: U1.N9(PB36B) U21.C4(DQ2)
PS1_DQ3: U1.N10(VREF4_2/PB46B) U21.D4(DQ3)
PS1_DQ4: U1.M9(PB38A) U21.D5(DQ4)
PS1_DQ5: U1.T10(PCLKC4_1/PB40B) U21.E3(DQ5)
PS1_DQ6: U1.T9(PLCKT4_1/PB40A) U21.E2(DQ6)
PS1_DQ7: U1.T8(PB30B) U21.E1(DQ7)
PS1_RST: U1.P7(PB32B) U21.A4(RESET#)
PS1_RW: U1.N8(PB36A) U21.C3(RWDS)
NetC3_2: C3.2 C4.2 R7.1 U1.N6(VCCIO4)

Not connected (* = marked no-connect by the designer): U1 L8(PB34A) M10(PB46A) P4(PCLKC4_2/PB24B) P5(PB22B) P6(PB32A)

### Layout directives
differential pair: PS0_CK_N, PS0_CK_P, PS1_CK_N, PS1_CK_P
net class pram0: PS0_CK_N, PS0_CK_P, PS0_DQ0, PS0_DQ1, PS0_DQ2, PS0_DQ3, PS0_DQ4, PS0_DQ5, PS0_DQ6, PS0_DQ7, PS0_RW
net class pram1: PS1_CK_N, PS1_CK_P, PS1_DQ0, PS1_DQ1, PS1_DQ2, PS1_DQ3, PS1_DQ4, PS1_DQ5, PS1_DQ6, PS1_DQ7, PS1_RW

### Notes on the sheet
- Crosslink NX LIFCL-40 256 caBGA Core Board V1.0
- www.circuitvalley.com <http://www.circuitvalley.com>
- Title
- Size:
- Date:
- A3
- Number:
- Time:
- Revision:
- Sheet
- of
- (in symbol LIFCL-40-9BG256C, part G) BANK 4

### Library data of the parts
C3 C4 C29 C30 C44 C45 = CAPC_10n_0402_16V_10%: as C1 on sheet power; Tolerance: ±10%; Operating Temperature: -55°C ~ 125°C; Package / Case: 0402 (1005 Metric); Size / Dimension: 0.039" L x 0.020" W (1.00mm x 0.50mm); Manufacturer 2: Yageo; Manufacturer Part Number 2: CC0402KRX7R7BB103; Supplier 1: Digi-Key; Supplier Part Number 1: 478-1114-1-ND; ComponentLink1URL: http://www.avx.com/docs/Catalogs/cx7r.pdf; ComponentLink1Description: http://www.avx.com/docs/Catalogs/cx7r.pdf; Supplier 2: Digi-Key; Supplier Part Number 2: 311-1042-1-ND; ComponentLink2URL: http://www.yageo.com/documents/recent/UPY-GPHC_X7R_6.3V-to-50V_8.pdf; ComponentLink2Description: http://www.yageo.com/documents/recent/UPY-GPHC_X7R_6.3V-to-50V_8.pdf; Value: 100n
R7 = RES_3K3_0402_5%: as R1 on sheet power; Package / Case: 0402 (1005 metric); Tolerance: ±5%; Material: Thick Film; Supplier 1: Digi-Key; Supplier Part Number 1: 311-3.3KJRCT-ND; ComponentLink1URL: http://www.yageo.com/documents/recent/PYu-RC0402_51_RoHS_L_6.pdf; ComponentLink1Description: http://www.yageo.com/documents/recent/PYu-RC0402_51_RoHS_L_6.pdf
U1 = LIFCL-40-9BG256C: FPGA CorsslinkNX  LIFCL-40-9BG256C
U2 U21 = W957D8MFYA5I: HyperRAM 16Mx8

## Sheet fpga_flash.SchDoc
size A3
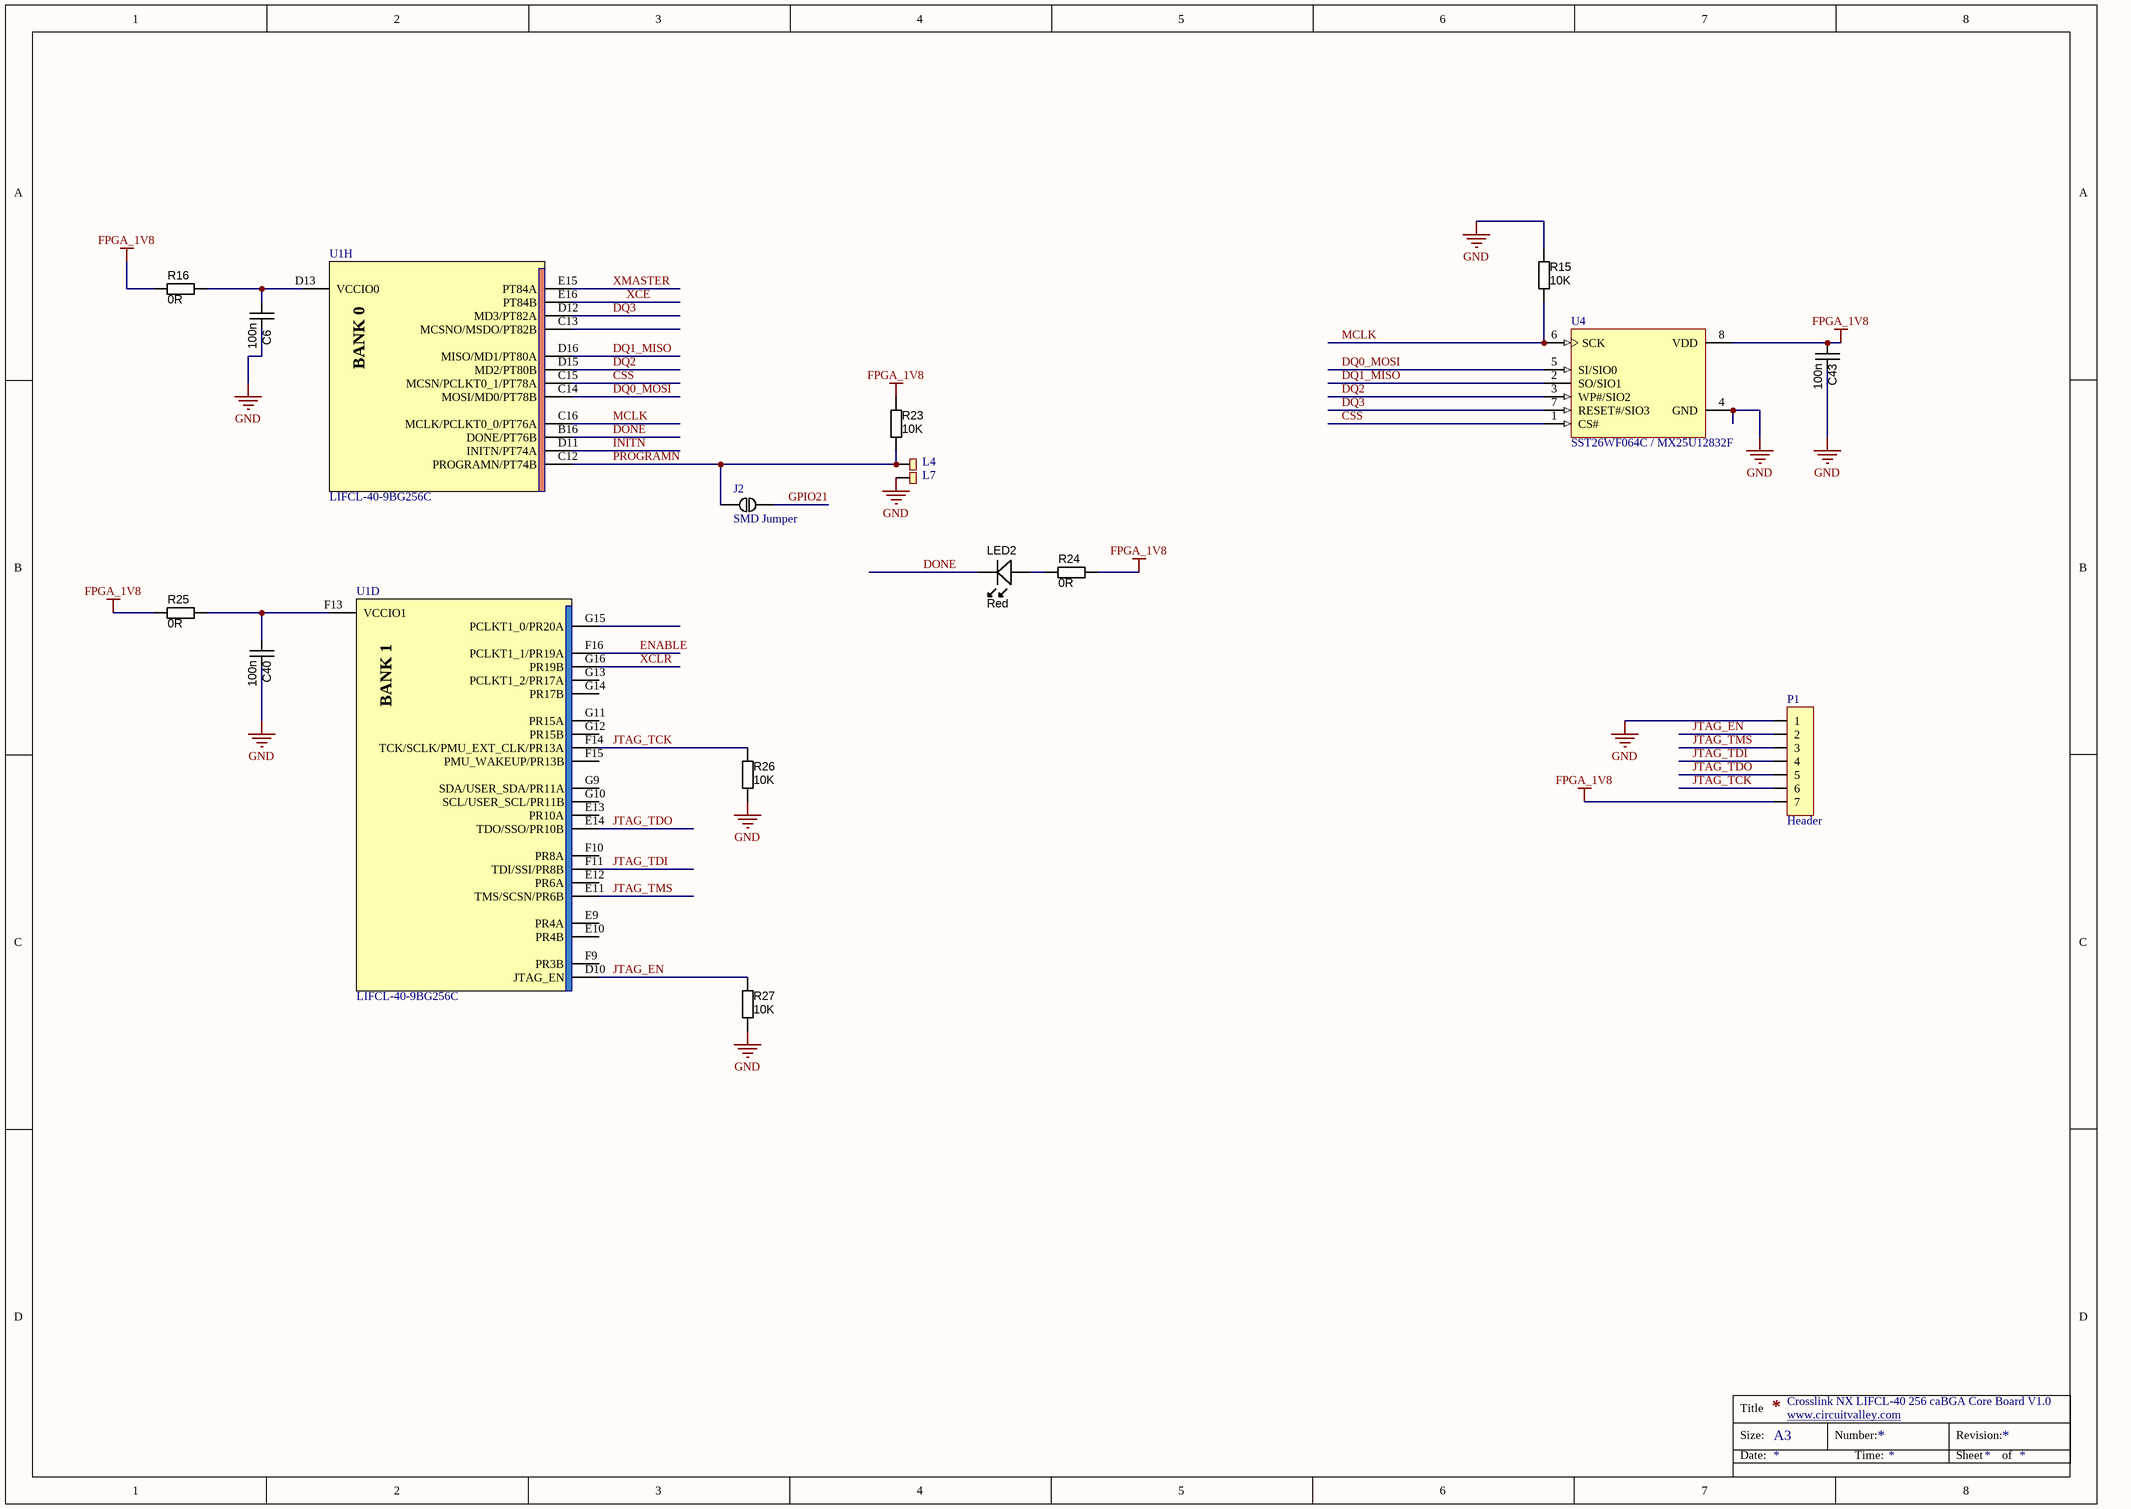
[diagram p5: fpga_flash.SchDoc]

### Parts
C6  100n  [CAPC1005N]
C40  100n  [CAPC1005N]
C43  100n  [CAPC1005N]
J2  SMD Jumper  [SMD_Jumper]
L4  TestPoint  [SMD_test_point]  (value not drawn)
L7  TestPoint  [SMD_test_point]  (value not drawn)
LED2  Red  [LED-0603-RED]
P1  Header  [SMD_Solder_points_1.27_x7]
R15  value 10K  [RESC1005N]  (hidden comment: Thick Film)
R16  value 0R  [RESC1005N]  (hidden comment: Thick Film)
R23  value 10K  [RESC1005N]  (hidden comment: Thick Film)
R24  value 0R  [RESC1005N]  (hidden comment: Thick Film)
R25  value 0R  [RESC1005N]  (hidden comment: Thick Film)
R26  value 10K  [RESC1005N]  (hidden comment: Thick Film)
R27  value 10K  [RESC1005N]  (hidden comment: Thick Film)
U1  LIFCL-40-9BG256C  [Lattice_256_CABGA]  (parts D,H of 14)
U4  SST26WF064C / MX25U12832F  [SOP8]

### Nets
FPGA_1V8: C43.2 P1.7 R16.1 R23.2 R24.1 R25.1 U4.8(VDD)
GND: C6.1 C40.1 C43.1 L7.1(TP) P1.1 R15.2 R26.1 R27.1 U4.4(GND)
CSS: U1.C15(MCSN/PCLKT0_1/PT78A) U4.1(CS#)
DONE: LED2.K U1.B16(DONE/PT76B)
DQ0_MOSI: U1.C14(MOSI/MD0/PT78B) U4.5(SI/SIO0)
DQ1_MISO: U1.D16(MISO/MD1/PT80A) U4.2(SO/SIO1)
DQ2: U1.D15(MD2/PT80B) U4.3(WP#/SIO2)
DQ3: U1.D12(MD3/PT82A) U4.7(RESET#/SIO3)
ENABLE: U1.F16(PCLKT1_1/PR19A)
GPIO21: J2.2
INITN: U1.D11(INITN/PT74A)
JTAG_EN: P1.2 R27.2 U1.D10(JTAG_EN)
JTAG_TCK: P1.6 R26.2 U1.F14(TCK/SCLK/PMU_EXT_CLK/PR13A)
JTAG_TDI: P1.4 U1.F11(TDI/SSI/PR8B)
JTAG_TDO: P1.5 U1.E14(TDO/SSO/PR10B)
JTAG_TMS: P1.3 U1.E11(TMS/SCSN/PR6B)
MCLK: R15.1 U1.C16(MCLK/PCLKT0_0/PT76A) U4.6(SCK)
PROGRAMN: J2.1 L4.1(TP) R23.1 U1.C12(PROGRAMN/PT74B)
XCE: U1.E16(PT84B)
XCLR: U1.G16(PR19B)
XMASTER: U1.E15(PT84A)
NetC6_2: C6.2 R16.2 U1.D13(VCCIO0)
NetC40_2: C40.2 R25.2 U1.F13(VCCIO1)
NetLED2_A: LED2.A R24.2

Not connected (* = marked no-connect by the designer): U1 C13(MCSNO/MSDO/PT82B) E9(PR4A) E10(PR4B) E12(PR6A) E13(PR10A) F9(PR3B) F10(PR8A) F15(PMU_WAKEUP/PR13B) G9(SDA/USER_SDA/PR11A) G10(SCL/USER_SCL/PR11B) G11(PR15A) G12(PR15B) G13(PCLKT1_2/PR17A) G14(PR17B) G15(PCLKT1_0/PR20A)

### Notes on the sheet
- Crosslink NX LIFCL-40 256 caBGA Core Board V1.0
- www.circuitvalley.com <http://www.circuitvalley.com>
- Title
- Size:
- Date:
- A3
- Number:
- Time:
- Revision:
- Sheet
- of
- (in symbol LIFCL-40-9BG256C, part D) BANK 1
- (in symbol LIFCL-40-9BG256C, part H) BANK 0

### Library data of the parts
C6 C40 C43 = CAPC_10n_0402_16V_10%: as C1 on sheet power; Tolerance: ±10%; Operating Temperature: -55°C ~ 125°C; Package / Case: 0402 (1005 Metric); Size / Dimension: 0.039" L x 0.020" W (1.00mm x 0.50mm); Manufacturer 2: Yageo; Manufacturer Part Number 2: CC0402KRX7R7BB103; Supplier 1: Digi-Key; Supplier Part Number 1: 478-1114-1-ND; ComponentLink1URL: http://www.avx.com/docs/Catalogs/cx7r.pdf; ComponentLink1Description: http://www.avx.com/docs/Catalogs/cx7r.pdf; Supplier 2: Digi-Key; Supplier Part Number 2: 311-1042-1-ND; ComponentLink2URL: http://www.yageo.com/documents/recent/UPY-GPHC_X7R_6.3V-to-50V_8.pdf; ComponentLink2Description: http://www.yageo.com/documents/recent/UPY-GPHC_X7R_6.3V-to-50V_8.pdf; Value: 100n
J2 = SMD_Jumper
L4 L7 = SMD_Test_Point: SMD Test Point
LED2 = LED_SMD_Red_0603_220mcd: LED 0603 SMD Hyper Red 630nm 220mcd 20mA; Manufacturer 1: Kingbright Corp; Manufacturer Part Number 1: APT1608SURCK; Material: AlGaInP on GaAs; Ratings: 220 mcd; 630 nm; Voltage - Forward (Vf) Typ: 1.95V; Voltage - Forward (Vf) @ 10mA: 1.9V; Package / Case: 0603 (1608 metric); Supplier 1: Digi-Key; Supplier Part Number 1: 754-1123-1-ND
P1 = Header_7Pin
R15 R16 R23-R27 = RES_3K3_0402_5%: as R1 on sheet power; Package / Case: 0402 (1005 metric); Tolerance: ±5%; Material: Thick Film; Supplier 1: Digi-Key; Supplier Part Number 1: 311-3.3KJRCT-ND; ComponentLink1URL: http://www.yageo.com/documents/recent/PYu-RC0402_51_RoHS_L_6.pdf; ComponentLink1Description: http://www.yageo.com/documents/recent/PYu-RC0402_51_RoHS_L_6.pdf
U1 = LIFCL-40-9BG256C: FPGA CorsslinkNX  LIFCL-40-9BG256C
U4 = MX25L12833F: Flash 128Mbit for Lattice FPGA

## Nets that join several sheets
+5V: camera (10 pins), power (12 pins)
FPGA_1V0: power (C27.2 C37.1 L3.2 R12.2), fpga_power (11 pins)
FPGA_1V8: power (C24.2 C35.1 L2.2 R8.2), fpga_gpif (5 pins), fpga_power (8 pins), psram (11 pins), fpga_flash (7 pins)
GND: camera (12 pins), power (17 pins), fpga_gpif (6 pins), fpga_power (53 pins), psram (12 pins), fpga_flash (9 pins)
LDO_1V0: power (C2.2 R1.2 U3.8), fpga_power (C28.2 FB1.2 U1.A2 U1.C4)
ENABLE: camera (J3.18), fpga_flash (U1.F16)
GPIO21: fpga_gpif (U1.N16), fpga_flash (J2.2)
XCE: camera (J3.24), fpga_flash (U1.E16)
XCLR: camera (J3.16), fpga_flash (U1.G16)
XMASTER: camera (J3.20), fpga_flash (U1.E15)